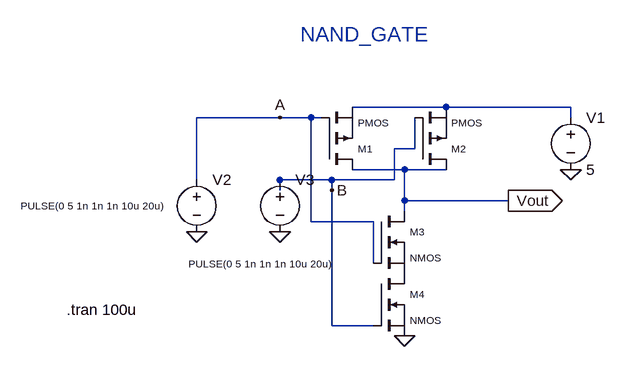
[diagram p0: schematic CMOS_NAND.asc]
CMOS_NAND.asc, the LTspice schematic file:
Version 4.1
SHEET 1 880 680
WIRE 288 48 144 48
WIRE 480 48 288 48
WIRE 32 64 -96 64
WIRE 80 64 32 64
WIRE 96 64 80 64
WIRE 480 64 480 48
WIRE 240 112 240 64
WIRE 240 112 208 112
WIRE 224 144 144 144
WIRE 288 144 224 144
WIRE -96 160 -96 64
WIRE 112 160 32 160
WIRE 208 160 208 112
WIRE 208 160 112 160
WIRE 32 176 32 160
WIRE 112 176 112 160
WIRE 224 192 224 144
WIRE 384 192 224 192
WIRE 224 208 224 192
WIRE 80 224 80 64
WIRE 176 224 80 224
WIRE 176 288 176 224
WIRE 112 384 112 176
WIRE 176 384 112 384
FLAG 224 400 0
FLAG 480 144 0
FLAG 384 192 Vout
IOPIN 384 192 Out
FLAG 32 64 A
FLAG 112 176 B
FLAG -96 240 0
FLAG 32 240 0
SYMBOL pmos 96 144 M180
WINDOW 0 56 32 Left 1
WINDOW 3 56 72 Left 1
SYMATTR InstName M1
SYMBOL pmos 240 144 M180
WINDOW 0 56 32 Left 1
WINDOW 3 56 72 Left 1
SYMATTR InstName M2
SYMBOL nmos 176 208 R0
WINDOW 0 56 32 Left 1
WINDOW 3 56 72 Left 1
SYMATTR InstName M3
SYMBOL nmos 176 304 R0
WINDOW 0 56 32 Left 1
WINDOW 3 56 72 Left 1
SYMATTR InstName M4
SYMBOL voltage 480 48 R0
WINDOW 123 0 0 Left 0
WINDOW 39 0 0 Left 0
SYMATTR InstName V1
SYMATTR Value 5
SYMBOL voltage -96 144 R0
WINDOW 3 -271 56 Left 1
WINDOW 123 0 0 Left 0
WINDOW 39 0 0 Left 0
SYMATTR Value PULSE(0 5 1n 1n 1n 10u 20u)
SYMATTR InstName V2
SYMBOL voltage 32 144 R0
WINDOW 123 0 0 Left 0
WINDOW 39 0 0 Left 0
WINDOW 3 -141 145 Left 1
SYMATTR InstName V3
SYMATTR Value PULSE(0 5 1n 1n 1n 10u 20u)
TEXT -296 360 Left 2 !.tran 100u
TEXT 64 -64 Left 3 ;NAND_GATE

The netlist it stands for:
* CMOS_NAND.asc
M1 Vout A N001 N001 PMOS
M2 Vout B N001 N001 PMOS
M3 Vout A P001 P001 NMOS
M4 P001 B 0 0 NMOS
V1 N001 0 5
V2 A 0 PULSE(0 5 1n 1n 1n 10u 20u)
V3 B 0 PULSE(0 5 1n 1n 1n 10u 20u)
.model NMOS NMOS
.model PMOS PMOS
.lib standard.mos
.tran 100u
* NAND_GATE
.backanno
.end